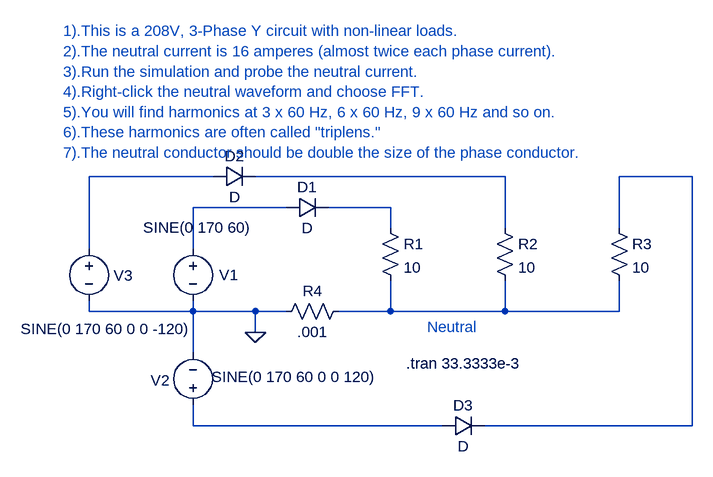
[diagram p0: schematic 3PhaseNonLinear.asc]
3PhaseNonLinear.asc, the LTspice schematic file:
Version 4
SHEET 1 932 680
WIRE 112 80 -80 80
WIRE 560 80 176 80
WIRE 848 80 736 80
WIRE 224 128 80 128
WIRE 384 128 288 128
WIRE 384 160 384 128
WIRE 560 160 560 80
WIRE 736 160 736 80
WIRE -80 192 -80 80
WIRE 80 192 80 128
WIRE -80 288 -80 272
WIRE 80 288 80 272
WIRE 80 288 -80 288
WIRE 176 288 80 288
WIRE 224 288 176 288
WIRE 384 288 384 240
WIRE 384 288 304 288
WIRE 560 288 560 240
WIRE 560 288 384 288
WIRE 736 288 736 240
WIRE 736 288 560 288
WIRE 176 320 176 288
WIRE 80 352 80 288
WIRE 80 464 80 432
WIRE 464 464 80 464
WIRE 848 464 848 80
WIRE 848 464 528 464
FLAG 176 320 0
SYMBOL voltage 80 176 R0
WINDOW 3 -77 -17 Left 2
WINDOW 123 0 0 Left 2
WINDOW 39 0 0 Left 2
WINDOW 0 40 56 Left 2
SYMATTR Value SINE(0 170 60)
SYMATTR InstName V1
SYMBOL voltage -80 176 R0
WINDOW 3 -105 139 Left 2
WINDOW 123 0 0 Left 2
WINDOW 39 0 0 Left 2
WINDOW 0 38 57 Left 2
SYMATTR Value SINE(0 170 60 0 0 -120)
SYMATTR InstName V3
SYMBOL res 368 144 R0
SYMATTR InstName R1
SYMATTR Value 10
SYMBOL res 544 144 R0
SYMATTR InstName R2
SYMATTR Value 10
SYMBOL res 720 144 R0
SYMATTR InstName R3
SYMATTR Value 10
SYMBOL res 320 272 R90
WINDOW 0 0 56 VBottom 2
WINDOW 3 32 56 VTop 2
SYMATTR InstName R4
SYMATTR Value .001
SYMBOL voltage 80 448 R180
WINDOW 0 36 54 Left 2
WINDOW 3 -283 59 Left 2
WINDOW 123 0 0 Left 2
WINDOW 39 0 0 Left 2
SYMATTR InstName V2
SYMATTR Value SINE(0 170 60 0 0 120)
SYMBOL diode 224 144 R270
WINDOW 0 32 32 VTop 2
WINDOW 3 0 32 VBottom 2
SYMATTR InstName D1
SYMBOL diode 112 96 R270
WINDOW 0 32 32 VTop 2
WINDOW 3 0 32 VBottom 2
SYMATTR InstName D2
SYMBOL diode 464 480 R270
WINDOW 0 32 32 VTop 2
WINDOW 3 0 32 VBottom 2
SYMATTR InstName D3
TEXT 408 368 Left 2 !.tran 33.3333e-3
TEXT 440 312 Left 2 ;Neutral
TEXT -120 -144 Left 2 ;1).This is a 208V, 3-Phase Y circuit with non-linear loads.\n2).The neutral current is 16 amperes (almost twice each phase current).\n3).Run the simulation and probe the neutral current.\n4).Right-click the neutral waveform and choose FFT.\n5).You will find harmonics at 3 x 60 Hz, 6 x 60 Hz, 9 x 60 Hz and so on.\n6).These harmonics are often called "triplens."\n7).The neutral conductor should be double the size of the phase conductor.

The netlist it stands for:
* 3PhaseNonLinear.asc
V1 N004 0 SINE(0 170 60)
V3 N001 0 SINE(0 170 60 0 0 -120)
R1 N005 N006 10
R2 N002 N006 10
R3 N003 N006 10
R4 N006 0 .001
V2 N007 0 SINE(0 170 60 0 0 120)
D1 N004 N005 D
D2 N001 N002 D
D3 N007 N003 D
.model D D
.lib standard.dio
.tran 33.3333e-3
* Neutral
* 1).This is a 208V, 3-Phase Y circuit with non-linear loads.
* 2).The neutral current is 16 amperes (almost twice each phase current).
* 3).Run the simulation and probe the neutral current.
* 4).Right-click the neutral waveform and choose FFT.
* 5).You will find harmonics at 3 x 60 Hz, 6 x 60 Hz, 9 x 60 Hz and so on.
* 6).These harmonics are often called "triplens."
* 7).The neutral conductor should be double the size of the phase conductor.
.backanno
.end